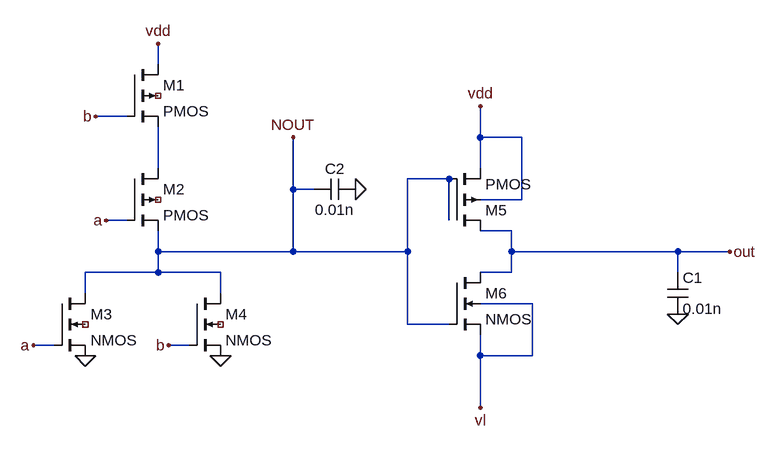
[diagram p0: schematic or_gate1.asc]
or_gate1.asc, the LTspice schematic file:
Version 4
SHEET 1 880 680
WIRE -144 -176 -144 -208
WIRE -192 -96 -240 -96
WIRE 352 -64 352 -112
WIRE 416 -64 352 -64
WIRE -144 -16 -144 -80
WIRE 352 -16 352 -64
WIRE 304 0 240 0
WIRE 64 16 64 -64
WIRE 96 16 64 16
WIRE 416 32 416 -64
WIRE 416 32 352 32
WIRE -192 64 -224 64
WIRE 304 64 304 0
WIRE 400 80 352 80
WIRE -144 112 -144 80
WIRE 64 112 64 16
WIRE 64 112 -144 112
WIRE 240 112 240 0
WIRE 240 112 64 112
WIRE 400 112 400 80
WIRE 656 112 400 112
WIRE 736 112 656 112
WIRE -144 144 -144 112
WIRE -144 144 -256 144
WIRE -48 144 -144 144
WIRE 400 144 400 112
WIRE 400 144 352 144
WIRE 656 144 656 112
WIRE -256 176 -256 144
WIRE -48 176 -48 144
WIRE 432 192 352 192
WIRE 240 224 240 112
WIRE 304 224 240 224
WIRE -304 256 -336 256
WIRE -96 256 -128 256
WIRE 352 272 352 240
WIRE 432 272 432 192
WIRE 432 272 352 272
WIRE 352 352 352 272
FLAG -144 -208 vdd
FLAG -240 -96 b
FLAG -224 64 a
FLAG 736 112 out
FLAG -128 256 b
FLAG -336 256 a
FLAG -48 272 0
FLAG -256 272 0
FLAG 656 208 0
FLAG 352 -112 vdd
FLAG 352 352 vl
FLAG 64 -64 NOUT
FLAG 160 16 0
SYMBOL pmos4 -192 -176 R0
SYMATTR InstName M1
SYMBOL pmos4 -192 -16 R0
SYMATTR InstName M2
SYMBOL nmos4 -304 176 R0
SYMATTR InstName M3
SYMBOL nmos4 -96 176 R0
SYMATTR InstName M4
SYMBOL cap 640 144 R0
SYMATTR InstName C1
SYMATTR Value 0.01n
SYMBOL pmos4 304 80 M180
SYMATTR InstName M5
SYMBOL nmos4 304 144 R0
SYMATTR InstName M6
SYMBOL cap 96 32 R270
WINDOW 0 32 32 VTop 2
WINDOW 3 0 32 VBottom 2
SYMATTR InstName C2
SYMATTR Value 0.01n

The netlist it stands for:
* or_gate1.asc
M1 vdd b N001 NC_01 PMOS
M2 N001 a NOUT NC_02 PMOS
M3 NOUT a 0 NC_03 NMOS
M4 NOUT b 0 NC_04 NMOS
C1 out 0 0.01n
M5 out NOUT vdd vdd PMOS
M6 out NOUT vl vl NMOS
C2 NOUT 0 0.01n
.model NMOS NMOS
.model PMOS PMOS
.lib standard.mos
.backanno
.end